# EAGLE design display_driver (EAGLE 7.5.0)
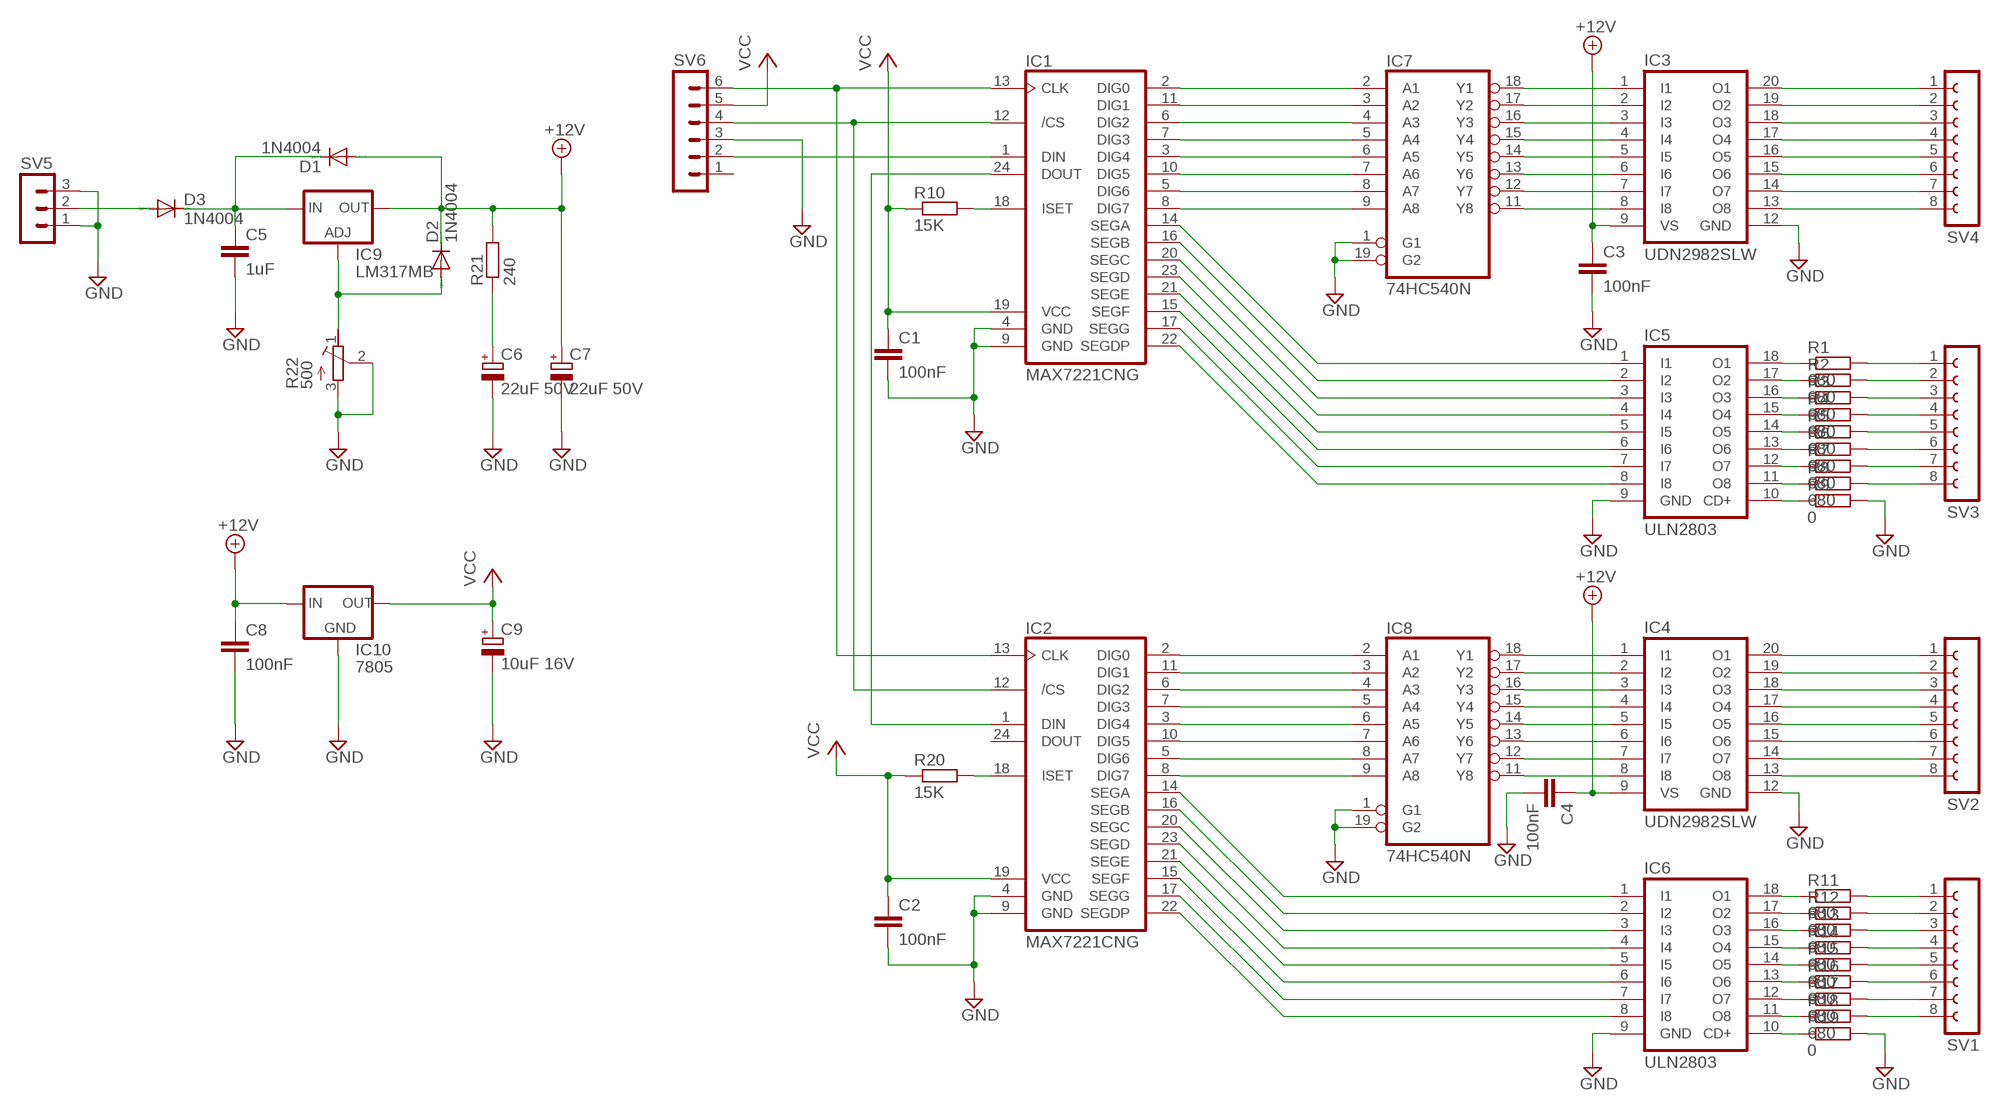
[diagram p0: schematic, sheet 1]

## Parts
C1  100nF  C5/2.5  [C5B2.5]
C2  100nF  C5/2.5  [C5B2.5]
C3  100nF  C5/2.5  [C5B2.5]
C4  100nF  C5/2.5  [C5B2.5]
C5  1uF  C5/2.5  [C5B2.5]
C6  22uF 50V  CPOL-EUE3.5-8  [E3,5-8]
C7  22uF 50V  CPOL-EUE3.5-8  [E3,5-8]
C8  100nF  C5/2.5  [C5B2.5]
C9  10uF 16V  CPOL-EUE3.5-8  [E3,5-8]
D1  1N4004  [DO41-10]
D2  1N4004  [DO41-10]
D3  1N4004  [DO41-10]
IC1  MAX7221CNG  [DIL24-3]
IC2  MAX7221CNG  [DIL24-3]
IC3  UDN2982SLW  [SO20W]
IC4  UDN2982SLW  [SO20W]
IC5  ULN2803  ULN2803A  [DIL18]
IC6  ULN2803  ULN2803A  [DIL18]
IC7  74HC540N  [DIL20]
IC8  74HC540N  [DIL20]
IC9  LM317MB  [TO220L1]
IC10  7805  78XXL  [78XXL]
R1  680  R-EU_0207/10  [0207/10]
R2  680  R-EU_0207/10  [0207/10]
R3  680  R-EU_0207/10  [0207/10]
R4  680  R-EU_0207/10  [0207/10]
R5  680  R-EU_0207/10  [0207/10]
R6  680  R-EU_0207/10  [0207/10]
R7  680  R-EU_0207/10  [0207/10]
R8  680  R-EU_0207/10  [0207/10]
R9  0  R-EU_0207/10  [0207/10]
R10  15K  R-EU_0207/10  [0207/10]
R11  680  R-EU_0207/10  [0207/10]
R12  680  R-EU_0207/10  [0207/10]
R13  680  R-EU_0207/10  [0207/10]
R14  680  R-EU_0207/10  [0207/10]
R15  680  R-EU_0207/10  [0207/10]
R16  680  R-EU_0207/10  [0207/10]
R17  680  R-EU_0207/10  [0207/10]
R18  680  R-EU_0207/10  [0207/10]
R19  0  R-EU_0207/10  [0207/10]
R20  15K  R-EU_0207/10  [0207/10]
R21  240  R-EU_0207/10  [0207/10]
R22  500  R-TRIMMT93YA  [RTRIMT93YA]
SV1  FE08-1  [FE08]
SV2  FE08-1  [FE08]
SV3  FE08-1  [FE08]
SV4  FE08-1  [FE08]
SV5  MA03-1  [MA03-1]
SV6  MA06-1  [MA06-1]

## Nets
+12V: C3.1 C4.1 C7.+ C8.1 D1.A D2.C IC3.9(VS) IC4.9(VS) IC9.2(OUT) IC10.IN R21.2
GND: C1.2 C2.2 C3.2 C4.2 C5.2 C6.- C7.- C8.2 C9.- IC1.4(GND) IC1.9(GND) IC2.4(GND) IC2.9(GND) IC3.12(GND) IC4.12(GND) IC5.9(GND) IC6.9(GND) IC7.1(G1) IC7.19(G2) IC8.1(G1) IC8.19(G2) IC10.GND R9.2 R19.2 R22.2(S) R22.3(A) SV5.1 SV5.3 SV6.3
N$1: IC1.2(DIG0) IC7.2(A1)
N$2: IC1.11(DIG1) IC7.3(A2)
N$3: IC1.6(DIG2) IC7.4(A3)
N$4: IC1.7(DIG3) IC7.5(A4)
N$5: IC1.3(DIG4) IC7.6(A5)
N$6: IC1.10(DIG5) IC7.7(A6)
N$7: IC1.5(DIG6) IC7.8(A7)
N$8: IC1.8(DIG7) IC7.9(A8)
N$9: IC3.1(I1) IC7.18(Y1)
N$10: IC3.2(I2) IC7.17(Y2)
N$11: IC3.3(I3) IC7.16(Y3)
N$12: IC3.4(I4) IC7.15(Y4)
N$13: IC3.5(I5) IC7.14(Y5)
N$14: IC3.6(I6) IC7.13(Y6)
N$15: IC3.7(I7) IC7.12(Y7)
N$16: IC3.8(I8) IC7.11(Y8)
N$17: IC1.14(SEGA) IC5.1(I1)
N$18: IC1.16(SEGB) IC5.2(I2)
N$19: IC1.20(SEGC) IC5.3(I3)
N$20: IC1.23(SEGD) IC5.4(I4)
N$21: IC1.21(SEGE) IC5.5(I5)
N$22: IC1.15(SEGF) IC5.6(I6)
N$23: IC1.17(SEGG) IC5.7(I7)
N$24: IC1.22(SEGDP) IC5.8(I8)
N$25: IC5.18(O1) R1.1
N$26: IC5.17(O2) R2.1
N$27: IC5.16(O3) R3.1
N$28: IC3.20(O1) SV4.1
N$29: IC3.19(O2) SV4.2
N$30: IC3.18(O3) SV4.3
N$31: IC3.17(O4) SV4.4
N$32: IC3.16(O5) SV4.5
N$33: IC3.15(O6) SV4.6
N$34: IC3.14(O7) SV4.7
N$35: IC5.15(O4) R4.1
N$36: IC5.14(O5) R5.1
N$37: IC5.13(O6) R6.1
N$38: IC5.12(O7) R7.1
N$39: IC5.11(O8) R8.1
N$40: IC3.13(O8) SV4.8
N$41: R1.2 SV3.1
N$42: R2.2 SV3.2
N$43: IC5.10(CD+) R9.1
N$44: IC1.18(ISET) R10.2
N$45: IC1.24(DOUT) IC2.1(DIN)
N$46: IC1.13(CLK) IC2.13(CLK) SV6.6
N$47: IC1.12(/CS) IC2.12(/CS) SV6.4
N$48: IC2.2(DIG0) IC8.2(A1)
N$49: IC2.11(DIG1) IC8.3(A2)
N$50: IC2.6(DIG2) IC8.4(A3)
N$51: IC2.7(DIG3) IC8.5(A4)
N$52: IC2.3(DIG4) IC8.6(A5)
N$53: IC2.10(DIG5) IC8.7(A6)
N$54: IC2.5(DIG6) IC8.8(A7)
N$55: IC2.8(DIG7) IC8.9(A8)
N$56: IC4.1(I1) IC8.18(Y1)
N$57: IC4.2(I2) IC8.17(Y2)
N$58: IC4.3(I3) IC8.16(Y3)
N$59: IC4.4(I4) IC8.15(Y4)
N$60: IC4.5(I5) IC8.14(Y5)
N$61: IC4.6(I6) IC8.13(Y6)
N$62: IC4.7(I7) IC8.12(Y7)
N$63: IC4.8(I8) IC8.11(Y8)
N$64: IC6.10(CD+) R19.1
N$65: IC2.14(SEGA) IC6.1(I1)
N$66: IC2.16(SEGB) IC6.2(I2)
N$67: IC2.20(SEGC) IC6.3(I3)
N$68: IC2.23(SEGD) IC6.4(I4)
N$69: IC2.21(SEGE) IC6.5(I5)
N$70: IC2.15(SEGF) IC6.6(I6)
N$71: IC2.17(SEGG) IC6.7(I7)
N$72: IC2.22(SEGDP) IC6.8(I8)
N$73: IC6.11(O8) R18.1
N$74: IC6.12(O7) R17.1
N$75: IC6.13(O6) R16.1
N$76: IC6.14(O5) R15.1
N$77: IC6.15(O4) R14.1
N$78: IC6.16(O3) R13.1
N$79: IC6.17(O2) R12.1
N$80: IC6.18(O1) R11.1
N$82: IC2.18(ISET) R20.2
N$83: C5.1 D1.C D3.C IC9.3(IN)
N$84: R3.2 SV3.3
N$85: D2.A IC9.1(ADJ) R22.1(E)
N$86: R4.2 SV3.4
N$87: C6.+ R21.1
N$88: D3.A SV5.2
N$89: IC1.1(DIN) SV6.2
N$90: R5.2 SV3.5
N$91: R6.2 SV3.6
N$92: R7.2 SV3.7
N$93: R8.2 SV3.8
N$94: IC4.20(O1) SV2.1
N$95: IC4.19(O2) SV2.2
N$96: IC4.18(O3) SV2.3
N$97: IC4.17(O4) SV2.4
N$98: IC4.16(O5) SV2.5
N$99: IC4.15(O6) SV2.6
N$100: IC4.14(O7) SV2.7
N$101: IC4.13(O8) SV2.8
N$102: R11.2 SV1.1
N$103: R12.2 SV1.2
N$104: R13.2 SV1.3
N$105: R14.2 SV1.4
N$106: R15.2 SV1.5
N$107: R16.2 SV1.6
N$108: R17.2 SV1.7
N$109: R18.2 SV1.8
VCC: C1.1 C2.1 C9.+ IC1.19(VCC) IC2.19(VCC) IC10.OUT R10.1 R20.1 SV6.5
Unconnected: IC2.24(DOUT) SV6.1

## Power pins joined to a net without a drawn wire
GND: IC7.10(GND) IC8.10(GND)
VCC: IC7.20(VCC) IC8.20(VCC)

## Library data of the parts
C1-C5 C8 = capacitor-wima:C: CAPACITOR naming: grid - package width
C6 C7 C9 = resistor:CPOL-EU: POLARIZED CAPACITOR, European symbol
D1-D3 = diode:1N4004: DIODE general purpose rectifier, 1 A
IC1 IC2 = maxim-5:MAX7221*: Serially Interfaced, 8-Digit LED Display Drivers
IC3 IC4 = uln-udn:UDN298*: DRIVER ARRAY Source: Allegro Microsystems Inc. / UDN2981-UDN2984.pdf
IC5 IC6 = uln-udn:ULN2803A: DRIVER ARRAY
IC7 IC8 = 74xx-eu:74*540: Octal BUFFER and LINE DRIVER, 3-state
IC9 = v-reg:LM317?*: 500 mA Adjustable Output Positive Voltage Regulator Source: http://www.onsemi.co.jp .. LM317M-D.PDF
IC10 = v-reg:78XXL: VOLTAGE REGULATOR
R1-R21 = rcl:R-EU_: RESISTOR, European symbol
R22 = resistor:R-TRIMM: Trimm resistor
SV1-SV4 = con-lsta:FE08-1: FEMALE HEADER; OC_FARNELL: unknown; OC_NEWARK: unknown
SV5 = con-lstb:MA03-1: PIN HEADER; OC_FARNELL: unknown; OC_NEWARK: unknown
SV6 = con-lstb:MA06-1: PIN HEADER; OC_FARNELL: unknown; OC_NEWARK: unknown

## Net classes
0 default: clearance 0.205 mm

## Board
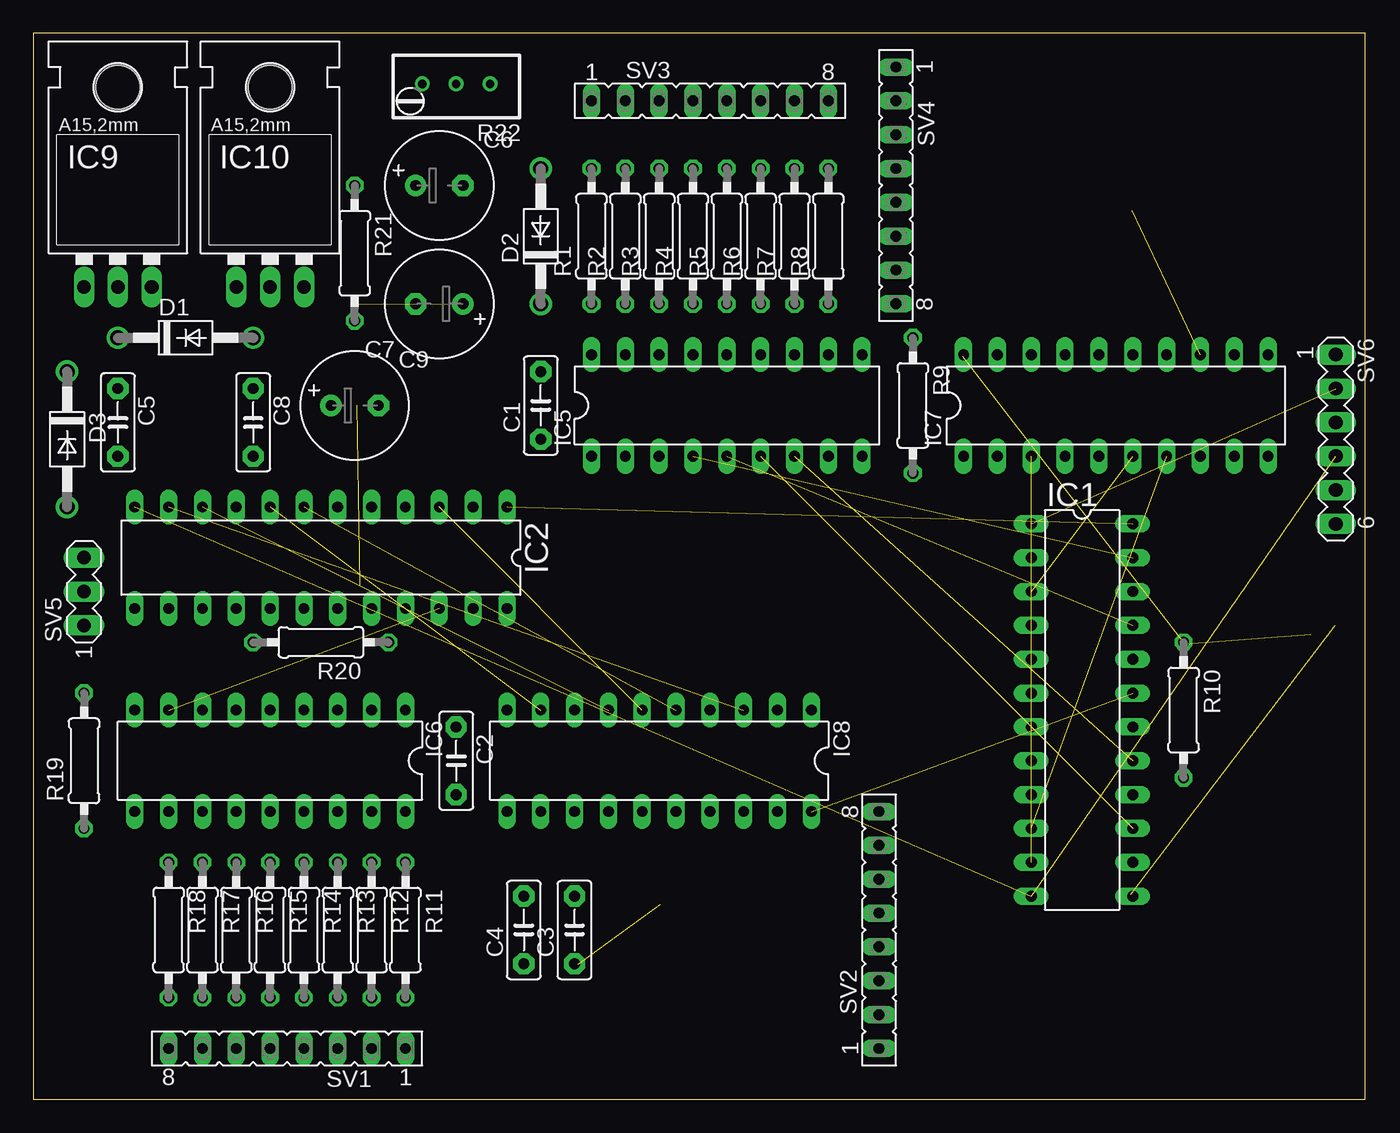
[diagram p1: board, top side]
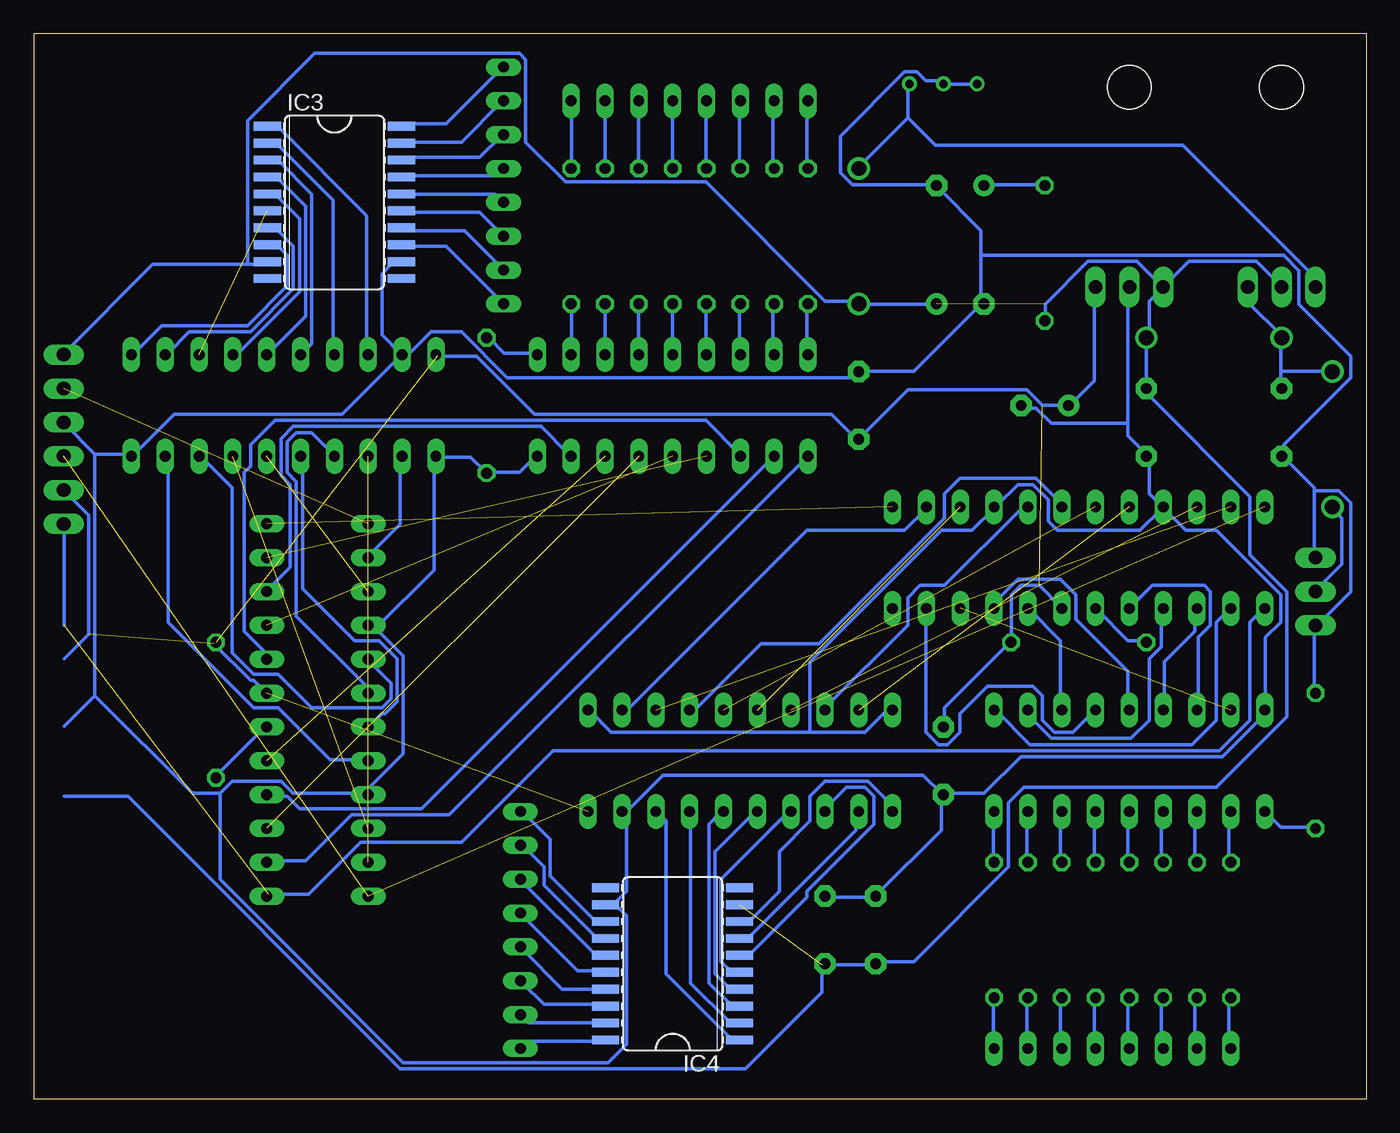
[diagram p2: board, bottom side, seen from below]

Size 100 x 80 mm. Coordinates in mm from the lower left corner, seen from the top.
Outline: 0,0 100,0 100,80 0,80 0,0
Copper layers (1*16): Top 0.035mm / dielectric 1.5mm / Bottom 0.035mm
Design rules "default": minimum track width 10mil, minimum drill 24mil, track to track 8mil, track to pad 8mil, pad to pad 8mil, via to via 8mil, smd to smd 8mil, copper to edge 40mil, drill to drill 8mil, minimum pad ring 10mil, minimum via ring 8mil, stop-mask expansion 4mil, vias tented up to drill 0mil, thermal gap 10mil

### Footprints (pad centres in the part's own frame; a part is rotated, then mirrored left to right if it is on the bottom)
C5B2.5 = drill 0.813 pad 1.6 octagon: 1 -2.54,0; 2 2.54,0
E3,5-8 = drill 0.813 pad 1.6: + -1.778,0 | drill 0.813 pad 1.6 octagon: - 1.778,0
DO41-10 = drill 1.118: A 5.08,0; C -5.08,0
DIL24-3 = drill 0.813 long: 1 -13.97,-3.81; 2 -11.43,-3.81; 3 -8.89,-3.81; 4 -6.35,-3.81; 5 -3.81,-3.81; 6 -1.27,-3.81; 7 1.27,-3.81; 8 3.81,-3.81; 9 6.35,-3.81; 10 8.89,-3.81; 11 11.43,-3.81; 12 13.97,-3.81; 13 13.97,3.81; 14 11.43,3.81; 15 8.89,3.81; 16 6.35,3.81; 17 3.81,3.81; 18 1.27,3.81; 19 -1.27,3.81; 20 -3.81,3.81; 21 -6.35,3.81; 22 -8.89,3.81; 23 -11.43,3.81; 24 -13.97,3.81
SO20W = smd 0.66 x 2.032: 1 -5.715,-5.029; 2 -4.445,-5.029; 3 -3.175,-5.029; 4 -1.905,-5.029; 5 -0.635,-5.029; 6 0.635,-5.029; 7 1.905,-5.029; 8 3.175,-5.029; 9 4.445,-5.029; 10 5.715,-5.029; 11 5.715,5.029; 12 4.445,5.029; 13 3.175,5.029; 14 1.905,5.029; 15 0.635,5.029; 16 -0.635,5.029; 17 -1.905,5.029; 18 -3.175,5.029; 19 -4.445,5.029; 20 -5.715,5.029
DIL18 = drill 0.813 long: 1 -10.16,-3.81; 2 -7.62,-3.81; 3 -5.08,-3.81; 4 -2.54,-3.81; 5 0,-3.81; 6 2.54,-3.81; 7 5.08,-3.81; 8 7.62,-3.81; 9 10.16,-3.81; 10 10.16,3.81; 11 7.62,3.81; 12 5.08,3.81; 13 2.54,3.81; 14 0,3.81; 15 -2.54,3.81; 16 -5.08,3.81; 17 -7.62,3.81; 18 -10.16,3.81
DIL20 = drill 0.813 long: 1 -11.43,-3.81; 2 -8.89,-3.81; 3 -6.35,-3.81; 4 -3.81,-3.81; 5 -1.27,-3.81; 6 1.27,-3.81; 7 3.81,-3.81; 8 6.35,-3.81; 9 8.89,-3.81; 10 11.43,-3.81; 11 11.43,3.81; 12 8.89,3.81; 13 6.35,3.81; 14 3.81,3.81; 15 1.27,3.81; 16 -1.27,3.81; 17 -3.81,3.81; 18 -6.35,3.81; 19 -8.89,3.81; 20 -11.43,3.81
TO220L1 = drill 1.016 long: 1 -2.54,-3.81; 2 0,-3.81; 3 2.54,-3.81 | hole 3.302: 0,11.176
78XXL = drill 1.016 long: GND 0,-3.81; IN -2.54,-3.81; OUT 2.54,-3.81 | hole 3.302: 0,11.176
0207/10 = drill 0.813 octagon: 1 -5.08,0; 2 5.08,0
RTRIMT93YA = drill 0.61: 1 0,-2.54; 2 0,0; 3 0,2.54
FE08 = drill 0.813 long: 1 -8.89,0; 2 -6.35,0; 3 -3.81,0; 4 -1.27,0; 5 1.27,0; 6 3.81,0; 7 6.35,0; 8 8.89,0
MA03-1 = drill 1.016 long: 1 -2.54,0; 2 0,0; 3 2.54,0
MA06-1 = drill 1.016 long: 1 -6.35,0; 2 -3.81,0; 3 -1.27,0; 4 1.27,0; 5 3.81,0; 6 6.35,0

### Placement (x,y rotation side)
C1  38.1,52.07 90 top
C2  31.75,25.4 270 top
C3  40.64,12.7 90 top
C4  36.83,12.7 90 top
C5  6.35,50.8 270 top
C6  30.48,68.58 0 top
C7  30.48,59.69 180 top
C8  16.51,50.8 270 top
C9  24.13,52.07 0 top
D1  11.43,57.15 0 top
D2  38.1,64.77 90 top
D3  2.54,49.53 270 top
IC1  78.74,29.21 270 top
IC2  21.59,40.64 180 top
IC3  77.47,67.31 270 bottom
IC4  52.07,10.16 90 bottom
IC5  52.07,52.07 0 top
IC6  17.78,25.4 180 top
IC7  81.28,52.07 0 top
IC8  46.99,25.4 180 top
IC9  6.35,64.77 0 top
IC10  17.78,64.77 0 top
R1  41.91,64.77 90 top
R2  44.45,64.77 90 top
R3  46.99,64.77 90 top
R4  49.53,64.77 90 top
R5  52.07,64.77 90 top
R6  54.61,64.77 90 top
R7  57.15,64.77 90 top
R8  59.69,64.77 90 top
R9  66.04,52.07 270 top
R10  86.36,29.21 270 top
R11  27.94,12.7 270 top
R12  25.4,12.7 270 top
R13  22.86,12.7 270 top
R14  20.32,12.7 270 top
R15  17.78,12.7 270 top
R16  15.24,12.7 270 top
R17  12.7,12.7 270 top
R18  10.16,12.7 270 top
R19  3.81,25.4 90 top
R20  21.59,34.29 180 top
R21  24.13,63.5 270 top
R22  31.75,76.2 90 top
SV1  19.05,3.81 180 top
SV2  63.5,12.7 90 top
SV3  50.8,74.93 0 top
SV4  64.77,68.58 270 top
SV5  3.81,38.1 90 top
SV6  97.79,49.53 270 top

### Tracks (layer width: path | path; a pad name or v marks a point on that pad's centre or on a via)
+12V  (2 unrouted)
  Bottom 0.254: R21.2 24.1,58.52 24.1,59.67 20.88,62.88 17.21,62.88 15.38,61.05 IC10.IN | IC9.2 6.43,61.05 8.26,62.88 13.31,62.88 15.15,61.05 IC10.IN | IC10.IN 15.38,60.82 16.29,59.9 16.29,57.38 D1.A 16.52,57.15 16.52,53.47 C8.1 16.29,53.24 16.29,52.78 8.72,45.21 8.72,40.85 5.97,38.1 5.97,28.69 11.24,23.41 25.7,23.41 26.85,22.26 26.85,17.44 33.97,10.33 36.72,10.33 C4.1 36.95,10.1 40.62,10.1 C3.1 40.85,10.1 40.85,8.03 46.59,2.29 72.52,2.29 92.95,22.72 97.77,22.72 | C7.+ 32.36,59.67 38.1,59.67 D2.C 38.33,59.9 40.62,59.9 49.57,68.85 60.13,68.85 63.11,71.83 63.11,78.03 63.57,78.49 78.95,78.49 84,73.44 84,62.65 | 84,62.65 91.11,62.65 97.77,56 | 84,62.65 82.62,62.65 IC3.9
GND
  Bottom 0.254: 56.46,14.69 56.92,14.69 IC4.12 56.46,14.69 | 56.46,14.69 55.54,15.61 55.54,21.34 55.77,21.57 IC8.19 55.77,21.8 55.31,21.8 52.78,24.33 33.28,24.33 31.9,22.95 C2.2 | C3.2 40.62,15.15 36.95,15.15 C4.2 36.72,15.38 31.9,20.2 31.9,22.72 C2.2 | 17.9,50.72 17.9,49.8 16.52,48.42 C8.2 16.29,48.2 16.29,45.44 15.38,44.52 IC2.9 | 17.9,50.72 17.9,60.82 IC10.GND | 17.9,50.72 23.64,50.72 24.79,51.87 25.7,51.87 C9.- | 41.77,27.54 56.69,27.54 58.29,29.15 IC8.1 | 41.77,27.54 37.64,27.54 36.03,29.15 35.57,29.15 IC8.10 | IC2.9 15.15,44.29 13.54,42.69 11.24,42.69 6.43,37.87 6.43,35.8 7.57,34.65 7.57,29.38 IC6.9 7.8,29.15 7.8,28.69 10.79,25.7 25.93,25.7 28.69,22.95 31.67,22.95 C2.2 | IC2.9 15.38,44.29 16.98,42.69 23.18,42.69 23.87,43.38 23.87,44.98 25.02,46.13 26.16,46.13 27.77,44.52 IC2.4 28,44.29 29.61,42.69 31.9,42.69 41.77,32.82 41.77,27.54 | IC5.9 62.42,48.2 63.57,47.05 65.87,47.05 R9.2 66.1,47.05 67.24,48.2 69.77,48.2 IC7.1 70,48.2 70,39.7 74.36,35.34 | 74.36,35.34 72.29,33.28 72.29,25.93 74.82,23.41 74.82,22.95 IC1.9 75.05,22.95 80.56,22.95 81.47,23.87 85.14,23.87 86.06,22.95 | 74.36,35.34 74.82,35.34 IC1.4 74.36,35.34 | IC3.12 72.52,62.65 73.21,62.65 73.9,61.97 73.9,57.38 72.52,56 IC7.19 | 95.47,48.42 92.72,48.42 IC7.10 92.49,48.42 89.5,51.41 76.88,51.41 72.52,55.77 IC7.19 | 95.47,48.42 97.77,50.72 SV6.3 | 95.47,30.29 97.77,28 | 95.47,48.42 95.47,30.29 | 86.06,22.95 88.13,22.95 95.47,30.29 | R19.2 3.9,30.52 3.9,35.34 SV5.1 3.67,35.57 1.15,38.1 1.15,44.75 2.07,45.67 3.9,45.67 | 3.9,45.67 3.9,45.9 6.2,48.2 C5.2 6.2,48.42 6.2,49.11 1.15,54.16 1.15,55.77 5.05,59.67 5.05,62.19 6.2,63.34 28.92,63.34
  Bottom 0.254: 3.9,45.67 3.9,40.85 SV5.3 | R22.3 29.38,76.19 31.67,76.19 R22.2 31.9,76.42 33.05,76.42 33.74,77.11 34.65,77.11 39.47,72.29 39.47,69.54 38.56,68.62 32.36,68.62 C6.- 32.13,68.39 28.92,65.18 28.92,63.34 | 28.92,63.34 28.92,59.9 C7.- 28.92,59.67 33.97,54.62 38.1,54.62 C1.2 38.33,54.39 38.56,54.16 64.49,54.16 67.93,57.6 70.23,57.6 71.83,56 72.29,56 IC7.19 | 56.46,14.69 55.54,13.77 55.54,4.13 56.92,2.75 72.29,2.75 86.06,16.52 86.06,22.95
N$1
  Bottom 0.254: IC7.2 72.52,48.2 72.52,43.15 74.82,40.85 IC1.2
N$2  (1 unrouted)
N$3
  Bottom 0.254: IC1.6 75.05,30.52 75.05,30.98 80.33,36.26 80.33,46.36 81.01,47.05 81.01,49.34 80.33,50.03 79.18,50.03 77.57,48.42 IC7.4
N$4
  Bottom 0.254: IC1.7 74.82,28 73.9,28.92 73.67,28.92 72.75,29.84 72.75,33.05 74.13,34.42 75.97,34.42 79.87,38.33 79.87,48.2 IC7.5
N$5  (1 unrouted)
N$6  (1 unrouted)
N$7
  Bottom 0.254: IC1.5 74.82,32.82 73.21,31.21 73.21,30.06 73.9,29.38 79.18,29.38 81.7,31.9 83.54,31.9 85.14,33.51 85.14,45.9 87.44,48.2 IC7.8
N$8
  Bottom 0.254: IC1.8 75.05,25.47 77.8,25.47 81.7,29.38 83.54,29.38 89.96,35.8 89.96,48.2 IC7.9
N$9
  Bottom 0.254: IC3.1 82.39,72.98 81.7,72.98 75.05,66.33 75.05,56 IC7.18
N$10
  Bottom 0.254: IC3.2 82.39,71.6 81.7,71.6 77.57,67.47 77.57,56 IC7.17
N$11
  Bottom 0.254: IC3.3 82.39,70.46 81.7,70.46 79.18,67.93 79.18,56.69 79.87,56 IC7.16
N$12
  Bottom 0.254: IC3.4 82.39,69.08 81.7,69.08 79.64,67.01 79.64,58.75 82.39,56 IC7.15
N$13
  Bottom 0.254: IC3.5 82.39,67.93 81.93,67.93 80.1,66.1 80.1,60.59 84.92,55.77 IC7.14
N$14  (1 unrouted)
N$15
  Bottom 0.254: IC3.7 82.39,65.18 81.7,65.18 80.56,64.03 80.56,60.82 83.77,57.6 88.36,57.6 89.96,56 IC7.12
N$16
  Bottom 0.254: IC3.8 82.39,64.03 81.7,64.03 81.01,63.34 81.01,61.05 84,58.06 90.42,58.06 92.49,56 IC7.11
N$17
  Bottom 0.254: IC1.14 82.39,17.9 79.64,17.9 76.19,21.34 68.85,21.34 42,48.2 IC5.1
N$18
  Bottom 0.254: IC1.16 82.39,22.72 81.01,22.72 80.1,21.8 70.92,21.8 44.52,48.2 IC5.2
N$19
  Bottom 0.254: IC1.20 82.62,33.05 82.62,33.51 84.23,35.11 84.23,47.05 83.77,47.51 83.77,49.11 81.93,50.95 49.57,50.95 47.05,48.42 IC5.3
N$20  (1 unrouted)
N$21  (1 unrouted)
N$22  (1 unrouted)
N$23  (1 unrouted)
N$24
  Bottom 0.254: IC1.22 82.39,38.33 80.78,39.93 80.78,46.13 81.47,46.82 81.47,49.57 80.56,50.49 61.97,50.49 59.9,48.42 IC5.8
N$25
  Bottom 0.254: IC5.18 42,56 42,59.67 R1.1
N$26
  Bottom 0.254: IC5.17 44.52,56 44.52,59.67 R2.1
N$27
  Bottom 0.254: IC5.16 47.05,56 47.05,59.67 R3.1
N$28
  Bottom 0.254: IC3.20 72.29,73.21 69.08,73.21 64.95,77.34 SV4.1
N$29
  Bottom 0.254: IC3.19 72.29,71.83 67.93,71.83 64.95,74.82 SV4.2
N$30
  Bottom 0.254: IC3.18 72.29,70.69 66.56,70.69 64.95,72.29 SV4.3
N$31
  Bottom 0.254: IC3.17 72.29,69.31 65.41,69.31 64.95,69.77 SV4.4
N$32
  Bottom 0.254: IC3.16 72.29,67.93 65.41,67.93 64.95,67.47 SV4.5
N$33
  Bottom 0.254: SV4.6 66.56,66.56 72.29,66.56 IC3.15
N$34
  Bottom 0.254: IC3.14 72.29,65.18 67.7,65.18 64.95,62.42 SV4.7
N$35
  Bottom 0.254: IC5.15 49.57,56 49.57,59.67 R4.1
N$36
  Bottom 0.254: IC5.14 52.1,56 52.1,59.67 R5.1
N$37
  Bottom 0.254: IC5.13 54.62,56 54.62,59.67 R6.1
N$38
  Bottom 0.254: IC5.12 57.15,56 57.15,59.67 R7.1
N$39
  Bottom 0.254: IC5.11 59.67,56 59.67,59.67 R8.1
N$40
  Bottom 0.254: IC3.13 72.29,64.03 69.08,64.03 64.95,59.9 SV4.8
N$41
  Bottom 0.254: R1.2 42,70 42,74.82 SV3.1
N$42
  Bottom 0.254: R2.2 44.52,70 44.52,74.82 SV3.2
N$43
  Bottom 0.254: IC5.10 62.42,56 64.72,56 65.87,57.15 R9.1
N$44
  Bottom 0.254: R10.2 86.29,24.33 82.62,28 IC1.18
N$45  (1 unrouted)
N$46  (1 unrouted)
  Bottom 0.254: 97.77,35.57 97.77,43.15 SV6.6 | IC1.13 82.39,15.38 79.41,15.38 75.5,19.28 67.93,19.28 61.05,26.16 11.02,26.16 8.72,28.46 8.72,35.8 7.8,36.72 IC2.13
N$47  (2 unrouted)
N$48
  Bottom 0.254: IC8.2 55.77,29.38 55.31,29.38 42,42.69 34.65,42.69 33.05,44.29 IC2.2
N$49  (1 unrouted)
N$50
  Bottom 0.254: IC8.4 50.72,29.38 50.26,29.38 45.44,34.2 41.08,34.2 31.67,43.6 31.67,45.44 30.52,46.59 24.79,46.59 22.72,44.52 IC2.6
N$51  (1 unrouted)
N$52  (1 unrouted)
N$53  (1 unrouted)
N$54
  Bottom 0.254: IC2.5 25.47,44.29 25.93,44.29 31.67,38.56 33.51,38.56 34.42,37.64 34.42,35.57 40.62,29.38 IC8.8
N$55  (1 unrouted)
N$56
  Bottom 0.254: IC4.1 47.05,4.59 47.74,4.59 52.56,9.41 52.56,20.88 53.24,21.57 IC8.18
N$57
  Bottom 0.254: IC4.2 47.05,5.74 47.74,5.74 50.72,8.72 50.72,21.57 IC8.17
N$58
  Bottom 0.254: IC4.3 47.05,7.11 47.74,7.11 49.34,8.72 49.34,20.66 48.42,21.57 IC8.16
N$59
  Bottom 0.254: IC4.4 47.74,8.26 48.88,9.41 48.88,18.59 45.9,21.57 IC8.15
N$60
  Bottom 0.254: IC4.5 47.05,9.64 47.74,9.64 48.42,10.33 48.42,16.52 43.38,21.57 IC8.14
N$61
  Bottom 0.254: IC4.6 46.82,11.02 46.13,11.02 42,15.15 42,15.61 36.95,20.66 36.95,22.72 37.64,23.41 39.02,23.41 40.62,21.8 IC8.13
N$62
  Bottom 0.254: IC4.7 46.82,12.16 46.36,12.16 38.33,20.2 38.33,21.57 IC8.12
N$63
  Bottom 0.254: IC4.8 46.82,13.54 46.13,13.54 44.06,15.61 44.06,18.59 41.77,20.88 41.77,22.72 40.62,23.87 37.41,23.87 35.34,21.8 IC8.11
N$64
  Bottom 0.254: R19.1 3.9,20.43 6.43,20.43 7.57,21.57 IC6.10
N$65
  Bottom 0.254: IC6.1 27.77,29.15 25.25,26.62 13.08,26.62 11.24,28.46 11.24,35.8 10.33,36.72 IC2.14
N$66
  Bottom 0.254: IC6.2 25.25,29.15 25.25,28.69 23.64,27.08 17.67,27.08 16.29,28.46 16.29,33.05 15.38,33.97 15.38,36.72 IC2.16
N$67
  Bottom 0.254: IC6.3 22.95,29.38 22.95,34.42 25.25,36.72 IC2.20
N$68
  Bottom 0.254: IC6.4 20.43,29.15 22.03,27.54 23.41,27.54 24.33,28.46 24.33,30.29 25.02,30.98 28.46,30.98 30.52,28.92 30.52,27.54 31.44,26.62 32.13,26.62 33.05,27.54 33.05,36.72 IC2.23
N$69
  Bottom 0.254: IC6.5 17.9,29.38 17.9,32.13 21.8,36.03 21.8,37.87 22.95,39.02 26.16,39.02 27.77,37.41 27.77,36.95 IC2.21
N$70
  Bottom 0.254: IC2.15 12.85,36.72 12.85,35.11 15.15,32.82 15.15,29.38 IC6.6
N$71
  Bottom 0.254: IC6.7 12.62,29.38 12.62,34.65 11.7,35.57 11.7,38.1 12.16,38.56 16.07,38.56 17.67,36.95 IC2.17
N$72  (1 unrouted)
N$73
  Bottom 0.254: R18.1 10.33,17.9 10.33,21.57 IC6.11
N$74
  Bottom 0.254: R17.1 12.85,17.9 12.85,21.57 IC6.12
N$75
  Bottom 0.254: R16.1 15.38,17.9 15.38,21.57 IC6.13
N$76
  Bottom 0.254: R15.1 17.9,17.9 17.9,21.57 IC6.14
N$77
  Bottom 0.254: R14.1 20.43,17.9 20.43,21.57 IC6.15
N$78
  Bottom 0.254: R13.1 22.95,17.9 22.95,21.57 IC6.16
N$79
  Bottom 0.254: R12.1 25.47,17.9 25.47,21.57 IC6.17
N$80
  Bottom 0.254: R11.1 28,17.9 28,21.57 IC6.18
N$82
  Bottom 0.254: R20.2 16.52,34.42 17.9,34.42 20.2,36.72 IC2.18
N$83
  Bottom 0.254: IC9.3 8.72,60.82 8.72,59.67 6.43,57.38 D1.C 6.43,57.15 6.43,54.62 | 6.43,54.62 6.43,53.47 C5.1 | 6.43,54.62 2.75,54.62 D3.C
N$84
  Bottom 0.254: R3.2 47.05,70 47.05,74.82 SV3.3
N$85
  Bottom 0.254: 34.42,73.67 34.42,76.19 R22.1 | 34.42,73.67 38.1,70 D2.A | 34.42,73.67 32.36,71.6 13.77,71.6 3.9,61.74 3.9,61.05 IC9.1
N$86
  Bottom 0.254: R4.2 49.57,70 49.57,74.82 SV3.4
N$87
  Bottom 0.254: R21.1 24.33,68.62 28.69,68.62 C6.+
N$88
  Bottom 0.254: SV5.2 3.67,38.33 1.84,40.16 1.84,43.6 2.52,44.29 D3.A
N$89  (1 unrouted)
N$90
  Bottom 0.254: R5.2 52.1,70 52.1,74.82 SV3.5
N$91
  Bottom 0.254: R6.2 54.62,70 54.62,74.82 SV3.6
N$92
  Bottom 0.254: R7.2 57.15,70 57.15,74.82 SV3.7
N$93
  Bottom 0.254: R8.2 59.67,70 59.67,74.82 SV3.8
N$94
  Bottom 0.254: IC4.20 57.15,4.36 62.88,4.36 63.34,3.9 SV2.1
N$95
  Bottom 0.254: IC4.19 57.15,5.74 62.88,5.74 63.34,6.2 SV2.2
N$96
  Bottom 0.254: IC4.18 57.15,7.11 61.74,7.11 63.34,8.72 SV2.3
N$97
  Bottom 0.254: IC4.17 57.15,8.26 60.36,8.26 63.34,11.24 SV2.4
N$98
  Bottom 0.254: IC4.16 57.15,9.64 59.21,9.64 63.34,13.77 SV2.5
N$99
  Bottom 0.254: IC4.15 57.15,11.02 58.06,11.02 63.34,16.29 SV2.6
N$100
  Bottom 0.254: IC4.14 57.15,12.16 57.83,12.16 61.74,16.07 61.74,17.44 63.34,19.05 SV2.7
N$101
  Bottom 0.254: IC4.13 57.15,13.54 58.06,13.54 61.28,16.75 61.28,19.51 63.34,21.57 SV2.8
N$102
  Bottom 0.254: SV1.1 28,3.9 28,7.57 R11.2
N$103
  Bottom 0.254: SV1.2 25.47,3.9 25.47,7.57 R12.2
N$104
  Bottom 0.254: SV1.3 22.95,3.9 22.95,7.57 R13.2
N$105
  Bottom 0.254: SV1.4 20.43,3.9 20.43,7.57 R14.2
N$106
  Bottom 0.254: SV1.5 17.9,3.9 17.9,7.57 R15.2
N$107
  Bottom 0.254: SV1.6 15.38,3.9 15.38,7.57 R16.2
N$108
  Bottom 0.254: SV1.7 12.85,3.9 12.85,7.57 R17.2
N$109
  Bottom 0.254: SV1.8 10.33,3.9 10.33,7.57 R18.2
VCC  (4 unrouted)
  Bottom 0.254: IC2.19 22.95,36.95 24.56,38.56 25.93,38.56 26.62,37.87 26.62,34.42 R20.1 26.85,34.2 31.67,29.38 31.67,28 C2.1 | IC10.OUT 20.43,60.82 20.43,53.93 22.26,52.1 C9.+ 22.49,52.1 24.33,52.1 25.47,53.24 34.42,53.24 38.1,49.57 C1.1 38.33,49.57 40.16,51.41 62.42,51.41 66.78,55.77 69.77,55.77 IC7.20 | IC1.19 82.62,30.52 83.54,31.44 83.77,31.44 86.52,34.2 R10.1 | 97.77,33.05 95.93,34.88 95.93,43.83 97.77,45.67 SV6.5